# Altium schematic sheet Sheet1.SchDoc: 8-Port USB Video Switch
size B; Author: Micah Dowty; DrawnBy: Micah Dowty; Revision: A
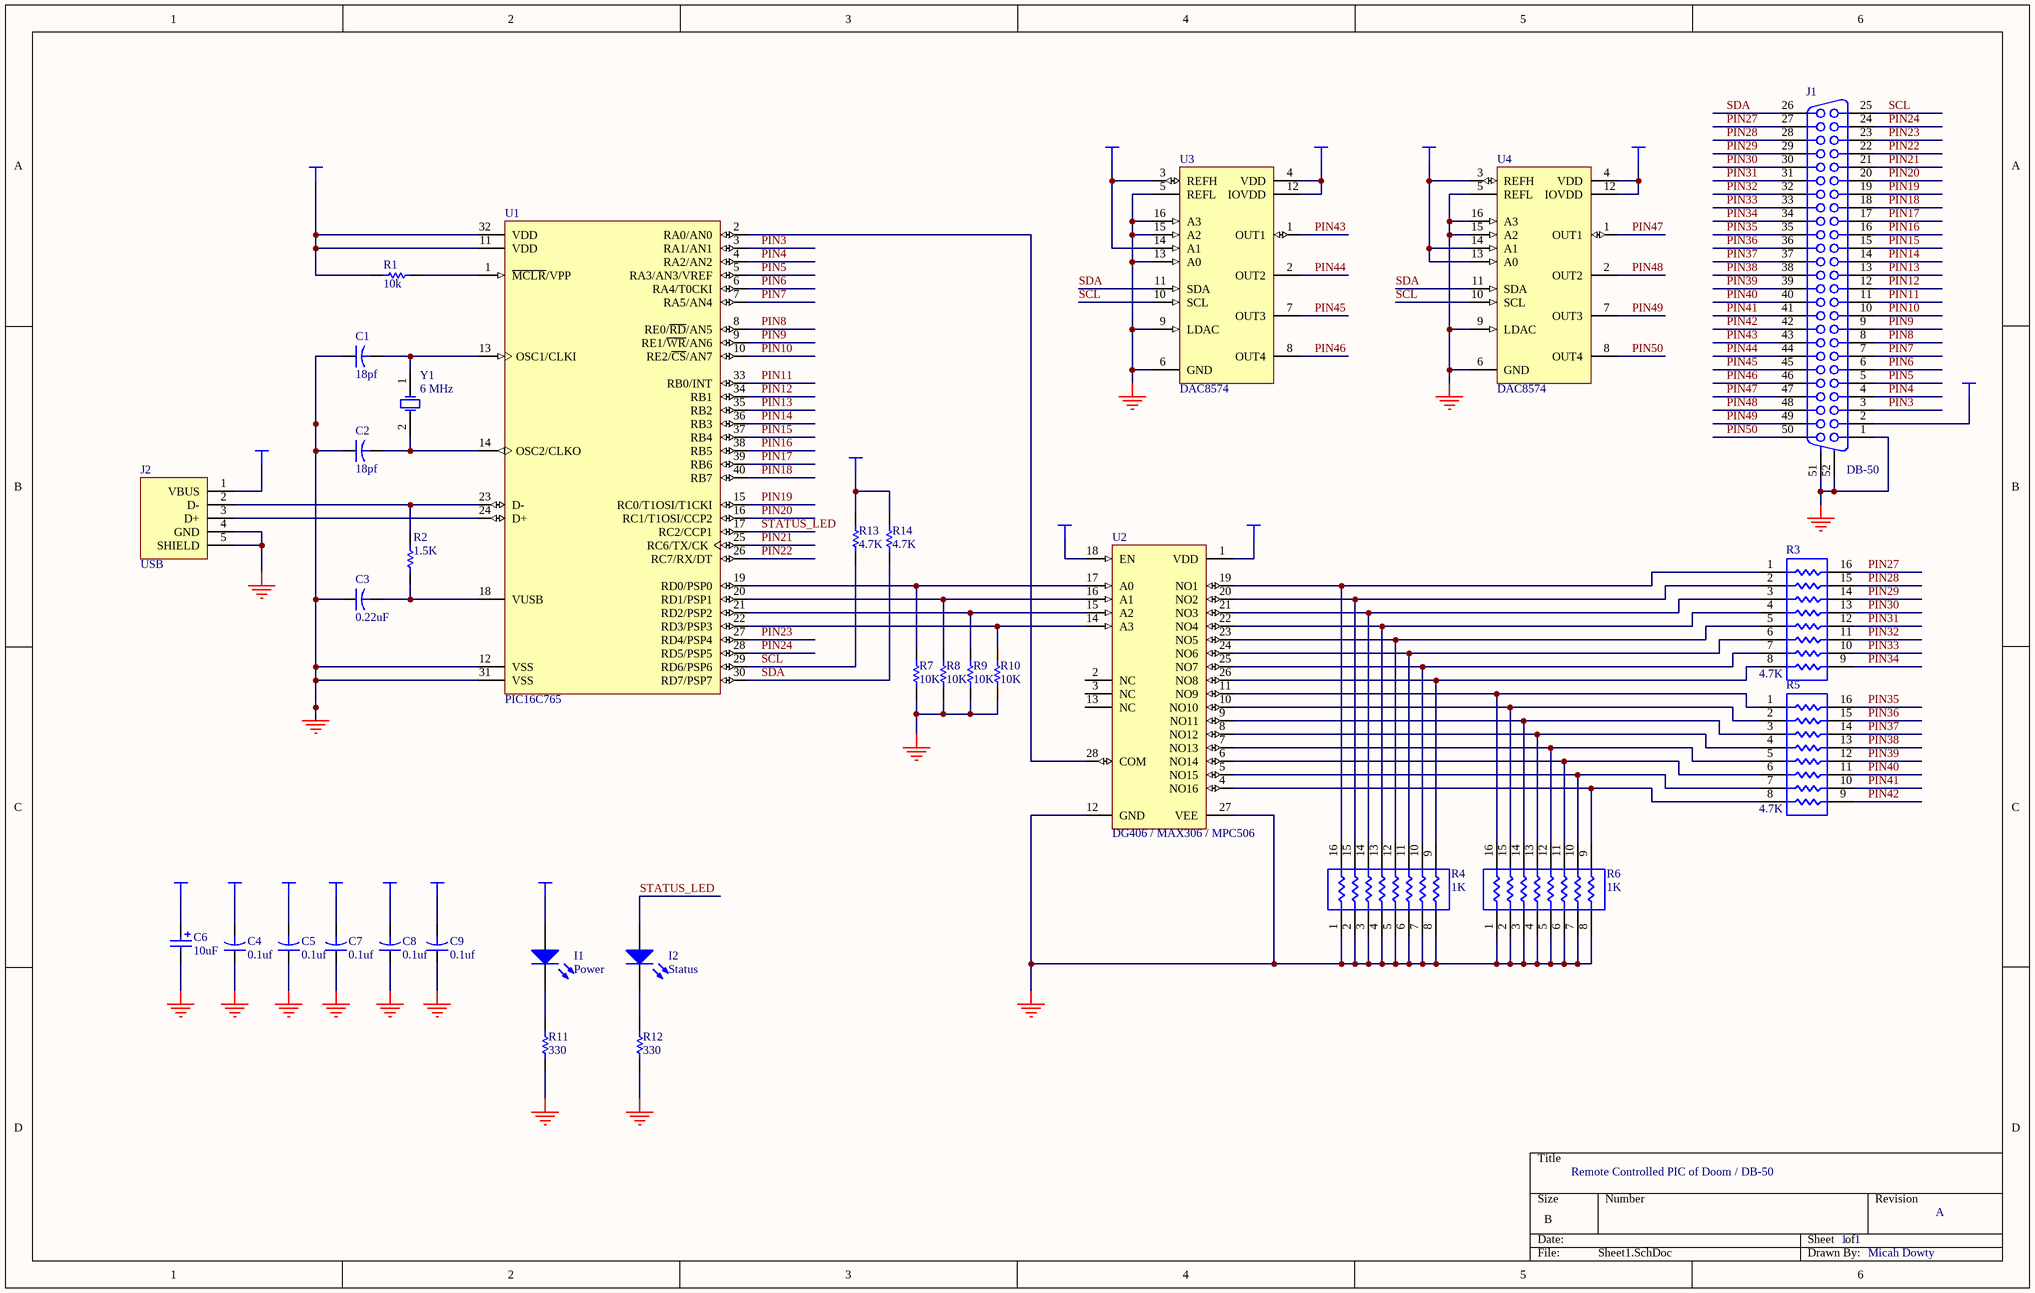
[diagram p0: Sheet1.SchDoc]

## Parts
C1  value 18pf  [C1005-0402]  (hidden comment: Cap2)
C2  value 18pf  [C1005-0402]  (hidden comment: Cap2)
C3  value 0.22uF  [C1005-0402]
C4  value 0.1uf  [C1005-0402]
C5  value 0.1uf  [C1005-0402]
C6  10uF  [CC4532-1812/Y1.8]
C7  value 0.1uf  [C1005-0402]
C8  value 0.1uf  [C1005-0402]
C9  value 0.1uf  [C1005-0402]
I1  Power  [LED-1-UNBROKE]
I2  Status  [LED-1-UNBROKE]
J1  DB-50  [NORCOMP-DB50]
J2  USB  [USB-TYPEB]
R1  value 10k  [C1005-0402]  (hidden comment: Res1)
R2  value 1.5K  [C1005-0402]  (hidden comment: Res1)
R3  value 4.7K  [EXB2HV]
R4  value 1K  [EXB2HV]
R5  value 4.7K  [EXB2HV]
R6  value 1K  [EXB2HV]
R7  value 10K  [C1005-0402]
R8  value 10K  [C1005-0402]
R9  value 10K  [C1005-0402]
R10  value 10K  [C1005-0402]
R11  value 330  [C1005-0402]
R12  value 330  [C1005-0402]
R13  value 4.7K  [C1005-0402]
R14  value 4.7K  [C1005-0402]
U1  PIC16C765  [DIP-40]
U2  DG406 / MAX306 / MPC506  [SO-G28/G7.45]
U3  DAC8574  [TSSO5X6-G16]
U4  DAC8574  [TSSO5X6-G16]
Y1  6 MHz  [BCY-W2/E4.7]

## Nets
GND: C1.1 C2.1 C3.1 C4.1 C5.1 C6.2 C7.1 C8.1 C9.1 J1.1 J1.51(MH1) J1.52(MH2) J2.4(GND) J2.5(SHIELD) R4.1 R4.2 R4.3 R4.4 R4.5 R4.6 R4.7 R4.8 R6.1 R6.2 R6.3 R6.4 R6.5 R6.6 R6.7 R6.8 R7.1 R8.1 R9.1 R10.1 R11.2 R12.2 U1.12(VSS) U1.31(VSS) U2.12(GND) U2.27(VEE) U3.5(REFL) U3.6(GND) U3.9(LDAC) U3.13(A0) U3.15(A2) U3.16(A3) U4.5(REFL) U4.6(GND) U4.9(LDAC) U4.15(A2) U4.16(A3)
VCC: C4.2 C5.2 C6.1 C7.2 C8.2 C9.2 I1.1(A) J1.2 J2.1(VBUS) R1.2 R13.2 R14.2 U1.11(VDD) U1.32(VDD) U2.1(VDD) U2.18(EN) U3.3(REFH) U3.4(VDD) U3.12(IOVDD) U3.14(A1) U4.3(REFH) U4.4(VDD) U4.12(IOVDD) U4.13(A0) U4.14(A1)
PIN3: J1.3 U1.3(RA1/AN1)
PIN4: J1.4 U1.4(RA2/AN2)
PIN5: J1.5 U1.5(RA3/AN3/VREF)
PIN6: J1.6 U1.6(RA4/T0CKI)
PIN7: J1.7 U1.7(RA5/AN4)
PIN8: J1.8 U1.8(RE0/~{RD}/AN5)
PIN9: J1.9 U1.9(RE1/~{WR}/AN6)
PIN10: J1.10 U1.10(RE2/~{CS}/AN7)
PIN11: J1.11 U1.33(RB0/INT)
PIN12: J1.12 U1.34(RB1)
PIN13: J1.13 U1.35(RB2)
PIN14: J1.14 U1.36(RB3)
PIN15: J1.15 U1.37(RB4)
PIN16: J1.16 U1.38(RB5)
PIN17: J1.17 U1.39(RB6)
PIN18: J1.18 U1.40(RB7)
PIN19: J1.19 U1.15(RC0/T1OSI/T1CKI)
PIN20: J1.20 U1.16(RC1/T1OSI/CCP2)
PIN21: J1.21 U1.25(RC6/TX/CK)
PIN22: J1.22 U1.26(RC7/RX/DT)
PIN23: J1.23 U1.27(RD4/PSP4)
PIN24: J1.24 U1.28(RD5/PSP5)
PIN27: J1.27 R3.16
PIN28: J1.28 R3.15
PIN29: J1.29 R3.14
PIN30: J1.30 R3.13
PIN31: J1.31 R3.12
PIN32: J1.32 R3.11
PIN33: J1.33 R3.10
PIN34: J1.34 R3.9
PIN35: J1.35 R5.16
PIN36: J1.36 R5.15
PIN37: J1.37 R5.14
PIN38: J1.38 R5.13
PIN39: J1.39 R5.12
PIN40: J1.40 R5.11
PIN41: J1.41 R5.10
PIN42: J1.42 R5.9
PIN43: J1.43 U3.1(OUT1)
PIN44: J1.44 U3.2(OUT2)
PIN45: J1.45 U3.7(OUT3)
PIN46: J1.46 U3.8(OUT4)
PIN47: J1.47 U4.1(OUT1)
PIN48: J1.48 U4.2(OUT2)
PIN49: J1.49 U4.7(OUT3)
PIN50: J1.50 U4.8(OUT4)
SCL: J1.25 R13.1 U1.29(RD6/PSP6) U3.10(SCL) U4.10(SCL)
SDA: J1.26 R14.1 U1.30(RD7/PSP7) U3.11(SDA) U4.11(SDA)
STATUS_LED: I2.1(A) U1.17(RC2/CCP1)
NetC1_2: C1.2 U1.13(OSC1/CLKI) Y1.1(OSC1)
NetC2_2: C2.2 U1.14(OSC2/CLKO) Y1.2(OSC2)
NetC3_2: C3.2 R2.1 U1.18(VUSB)
NetI1_2: I1.2(K) R11.1
NetI2_2: I2.2(K) R12.1
NetJ2_2: J2.2(D-) R2.2 U1.23(D-)
NetJ2_3: J2.3(D+) U1.24(D+)
NetR1_1: R1.1 U1.1(~{MCLR}/VPP)
NetR3_1: R3.1 R4.16 U2.19(NO1)
NetR3_2: R3.2 R4.15 U2.20(NO2)
NetR3_3: R3.3 R4.14 U2.21(NO3)
NetR3_4: R3.4 R4.13 U2.22(NO4)
NetR3_5: R3.5 R4.12 U2.23(NO5)
NetR3_6: R3.6 R4.11 U2.24(NO6)
NetR3_7: R3.7 R4.10 U2.25(NO7)
NetR3_8: R3.8 R4.9 U2.26(NO8)
NetR5_1: R5.1 R6.16 U2.11(NO9)
NetR5_2: R5.2 R6.15 U2.10(NO10)
NetR5_3: R5.3 R6.14 U2.9(NO11)
NetR5_4: R5.4 R6.13 U2.8(NO12)
NetR5_5: R5.5 R6.12 U2.7(NO13)
NetR5_6: R5.6 R6.11 U2.6(NO14)
NetR5_7: R5.7 R6.10 U2.5(NO15)
NetR5_8: R5.8 R6.9 U2.4(NO16)
NetR7_2: R7.2 U1.19(RD0/PSP0) U2.17(A0)
NetR8_2: R8.2 U1.20(RD1/PSP1) U2.16(A1)
NetR9_2: R9.2 U1.21(RD2/PSP2) U2.15(A2)
NetR10_2: R10.2 U1.22(RD3/PSP3) U2.14(A3)
NetU1_2: U1.2(RA0/AN0) U2.28(COM)

Not connected (* = marked no-connect by the designer): U2 2(NC) 3(NC) 13(NC)

## Notes on the sheet
- Remote Controlled PIC of Doom / DB-50
- 1
- A
- Micah Dowty

## Library data of the parts
C1-C5 C7-C9 = Cap2: Capacitor; Manufacturer: Generic Components; Class I: Passive; Published: 23-Sep-2002; Publisher: Altium Limited; Class II: Capacitor
C6 = Cap Pol1: Polarized Capacitor (Radial); Manufacturer: Generic Components; Class I: Passive; Published: 8-Jun-2000; Revision: July-2002: Re-released for DXP Platform.; Publisher: Altium Limited; Class II: Capacitor; Value: 10uF
I1 I2 = LED1: Typical RED GaAs LED; Manufacturer: Generic Components; Class I: Optoelectronic; Published: 8-Jun-2000; Revision: July-2002: Re-released for DXP Platform.; Publisher: Altium Limited; Class II: LED
J1 = Connector 50: Receptacle Header Assemby; Manufacturer: Generic Components; Package Information: Latest Revision: B; Positions: 50; Published: 15-Jun-2001; Revision: July-2002: Re-released for DXP Platform.; Datasheet: (1-Oct-1983); Package Reference: 178240; Publisher: Altium Limited; Class I: Connector; Orientation: Right Angle
J2 = USB Type B: Header, 4-Pin; Manufacturer: Generic Components; Class I: Connector; Revision: July-2002: Re-released for DXP Platform.; Publisher: Altium Limited
R1 R2 R7-R14 = Res1: Resistor; Manufacturer: Generic Components; Class I: Passive; Published: 8-Jun-2000; Revision: July-2002: Re-released for DXP Platform.; Publisher: Altium Limited; Class II: Resistor
R3-R6 = Res Pack3: Resistor Array; Manufacturer: Generic Components; Class I: Passive; Published: 24-Mar-1999; Revision: July-2002: Re-released for DXP Platform.; Publisher: Altium Limited; Class II: Resistor
U1 = PIC16C765: EPROM-Based 8-Bit CMOS Microcontroller with USB; Manufacturer: Microchip; Revision: Modified for PIC16C745 by Micah Dowty; Package Reference: P40; Class I: Microcontroller; Class II: 8-bit
U2 = MAX306EPI: Precision, 16-Channel High-performance, CMOS Analog Multiplexer; Manufacturer: Maxim; Class I: Logic; Class II: Multiplexer/Encoder/Selector; Published: 16-Jan-2001; Revision: July-2002: Re-released for DXP Platform.; Datasheet: Latest Revision: Aug-1994; Package Reference: NI28A; Publisher: Altium Limited
U3 U4 = DAC8574: Quad 16-Bit Low Power Voltage Output I2C Interface DAC; Manufacturer: Texas Instruments; Class I: Converter; Class II: Digital to Analog
Y1 = XTAL: Crystal Oscillator; Manufacturer: Generic Components; Published: 8-Jun-2000; Revision: July-2002: Re-released for DXP Platform.; Publisher: Altium Limited; Class I: Oscillator; Class II: Crystal Oscillator